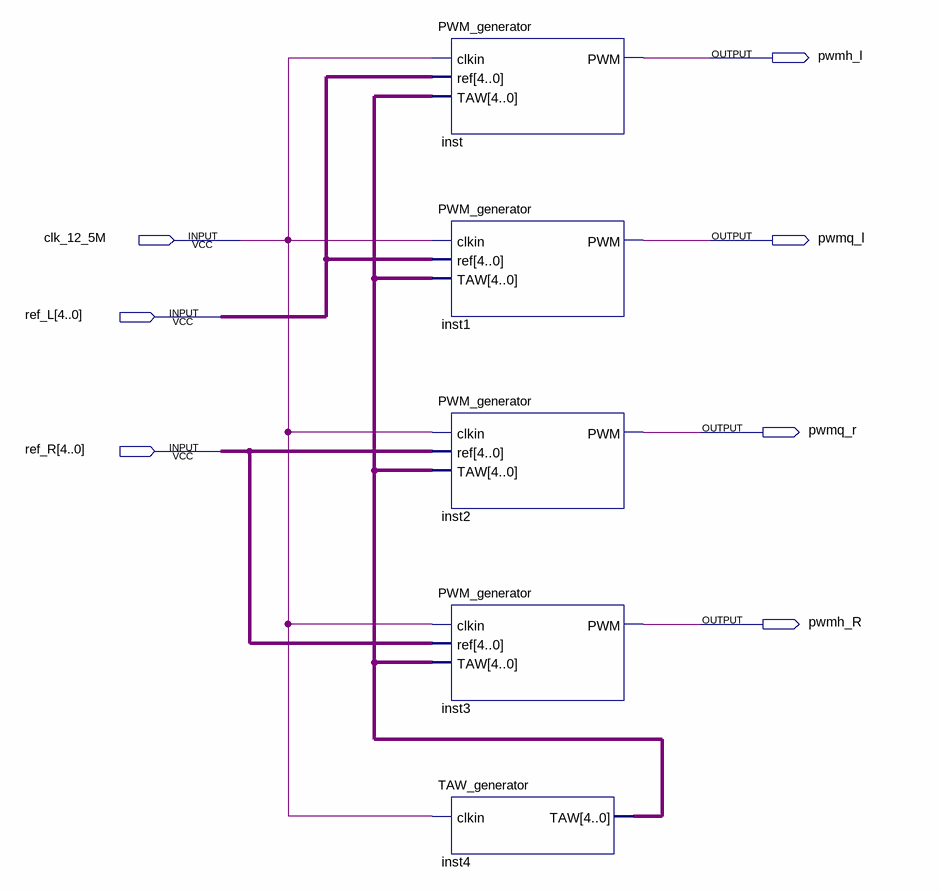
[diagram p0: schematic sheet]
// Quartus schematic pwm.bdf as structural Verilog: 5 symbols, 7 pins
module pwm (
  input  clk_12_5M,
  input  [4:0] ref_L,
  input  [4:0] ref_R,
  output pwmh_l,
  output pwmq_l,
  output pwmq_r,
  output pwmh_R
);

  wire [4:0] inst4_taw;

  PWM_generator inst (.clkin(clk_12_5M), .\ref (ref_L), .TAW(inst4_taw), .PWM(pwmh_l));
  PWM_generator inst1 (.clkin(clk_12_5M), .\ref (ref_L), .TAW(inst4_taw), .PWM(pwmq_l));
  PWM_generator inst2 (.clkin(clk_12_5M), .\ref (ref_R), .TAW(inst4_taw), .PWM(pwmq_r));
  PWM_generator inst3 (.clkin(clk_12_5M), .\ref (ref_R), .TAW(inst4_taw), .PWM(pwmh_R));
  TAW_generator inst4 (.clkin(clk_12_5M), .TAW(inst4_taw));
endmodule
